# Altium schematic sheet TK525_Hovedstrom.SchDoc: TK525 Hovedstrøm
size A3; Author: Øystein Smith; Organization: Omega Verksted; DocumentNumber: 14; Revision: 0; SheetNumber: 2; SheetTotal: 3
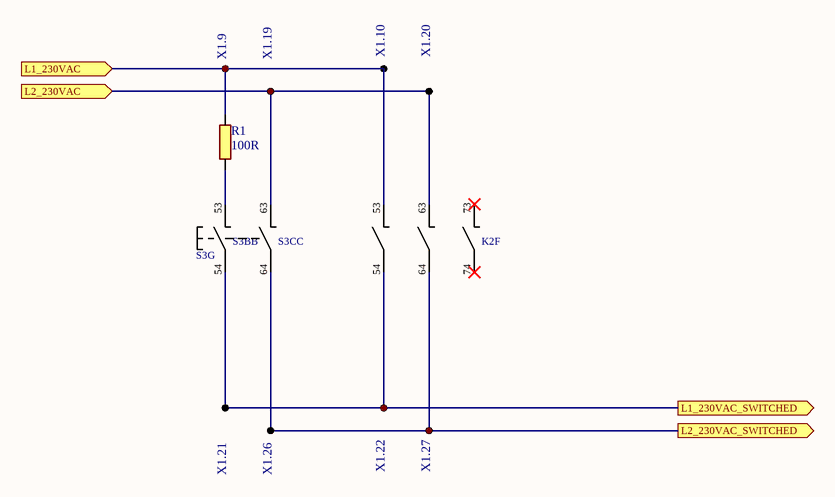
[diagram p0: TK525_Hovedstrom.SchDoc]

## Parts
K2  Kontaktor  [dummy]  (value not drawn)  (part F of 6)
R1  100R  [dummy]
S3  Automasjonsbryter  (value not drawn)  (part G of 10)
S3B  Automasjonsbryter NO  [dummy]  (value not drawn)  (part B of 3)
S3C  Automasjonsbryter NO  [dummy]  (value not drawn)  (part C of 3)
X1.9  Rekkeklemme 2.5mm2  [dummy]  (value not drawn)
X1.10  Rekkeklemme 2.5mm2  [dummy]  (value not drawn)
X1.19  Rekkeklemme 2.5mm2  [dummy]  (value not drawn)
X1.20  Rekkeklemme 2.5mm2  [dummy]  (value not drawn)
X1.21  Rekkeklemme 2.5mm2  [dummy]  (value not drawn)
X1.22  Rekkeklemme 2.5mm2  [dummy]  (value not drawn)
X1.26  Rekkeklemme 2.5mm2  [dummy]  (value not drawn)
X1.27  Rekkeklemme 2.5mm2  [dummy]  (value not drawn)

## Ports
L1_230VAC (in), L1_230VAC_SWITCHED (out), L2_230VAC (in), L2_230VAC_SWITCHED (out)

## Nets
L1_230VAC: K2.53 R1.2 ; port L1_230VAC
L1_230VAC_SWITCHED: K2.54 S3B.54 ; port L1_230VAC_SWITCHED
L2_230VAC: K2.63 S3C.63 ; port L2_230VAC
L2_230VAC_SWITCHED: K2.64 S3C.64 ; port L2_230VAC_SWITCHED
NetR1_1: R1.1 S3B.53

Not connected (* = marked no-connect by the designer): K2 73* 74*

## Notes on the sheet
- Size:
- Date:
- Title:
- A3
- Revision:
- Sheet
- of
- Author:
- File:

## Library data of the parts
K2 = 2948: Industriellt rele; id: 2948; symbol_opprettet_av: 815; leverandor_varenr: 9940480; pris: 300; produsent: IMO; leverandor: Farnell; symbol_opprettet: 04/07/2015 12:23:41; navn: Kontaktor; nokkelord: Contactor; pakketype: -; pakke_opprettet_av: 815; pakke_opprettet: 02/11/2021 00:12:53
R1 = 6251: 100 Ohm, 100W Resistor, Solder Lug, Wirewound +-5% 1.9kV; id: 6251; symbol_opprettet_av: 815; leverandor_varenr: 1768214; pris: 250; nokkelord: Motstand, resistor, 100, tesla, effekt, effektmotstand, power, lampe; produsent: TT electronics; leverandor: Farnell; komponenttype: 1; symbol_opprettet: 08/07/2014 21:16:33; navn: 100R; pakke_opprettet_av: 815; pakke_opprettet: 02/11/2021 00:12:53
S3 = 2949: Kraftig, Generisk for skjema; id: 2949; symbol_opprettet_av: 815; pris: 100; symbol_opprettet: 05/07/2015 13:10:20; navn: Automasjonsbryter; pakketype: -
S3B S3C = 6257: Contact Block, SPST-NO, 10 A, 500 V, 1 Pole, 3SU Series, Screw; id: 6257; symbol_opprettet_av: 815; leverandor_varenr: 2695771; pris: 80; nokkelord: bryter, switch, tesla; produsent: Siemens; leverandor: Farnell; symbol_opprettet: 01/11/2021 23:46:02; navn: Automasjonsbryter NO; pakke_opprettet_av: 815; pakke_opprettet: 02/11/2021 00:12:53
X1.9 X1.10 X1.19-X1.22 X1.26 X1.27 = 3304: DIN Rail mount terminal block; id: 3304; symbol_opprettet_av: 815; leverandor_varenr: 2061376; pris: 5; nokkelord: CDU2.5; produsent: Multicomp; leverandor: Farnell; komponenttype: 11; symbol_opprettet: 12/03/2017 00:15:42; navn: Rekkeklemme 2.5mm2; pakketype: -; pakke_opprettet_av: 815; pakke_opprettet: 02/11/2021 00:12:53